# EAGLE schematic AMR3350 (EAGLE 9.4.1)
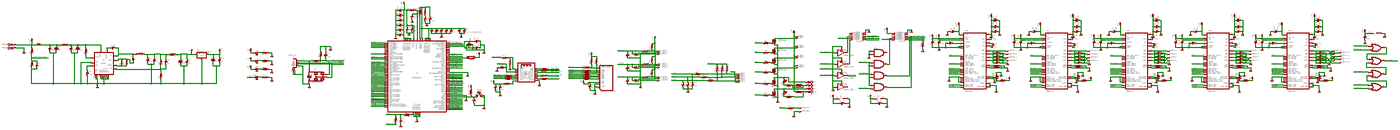
[diagram p0: schematic, sheet 1, overview]
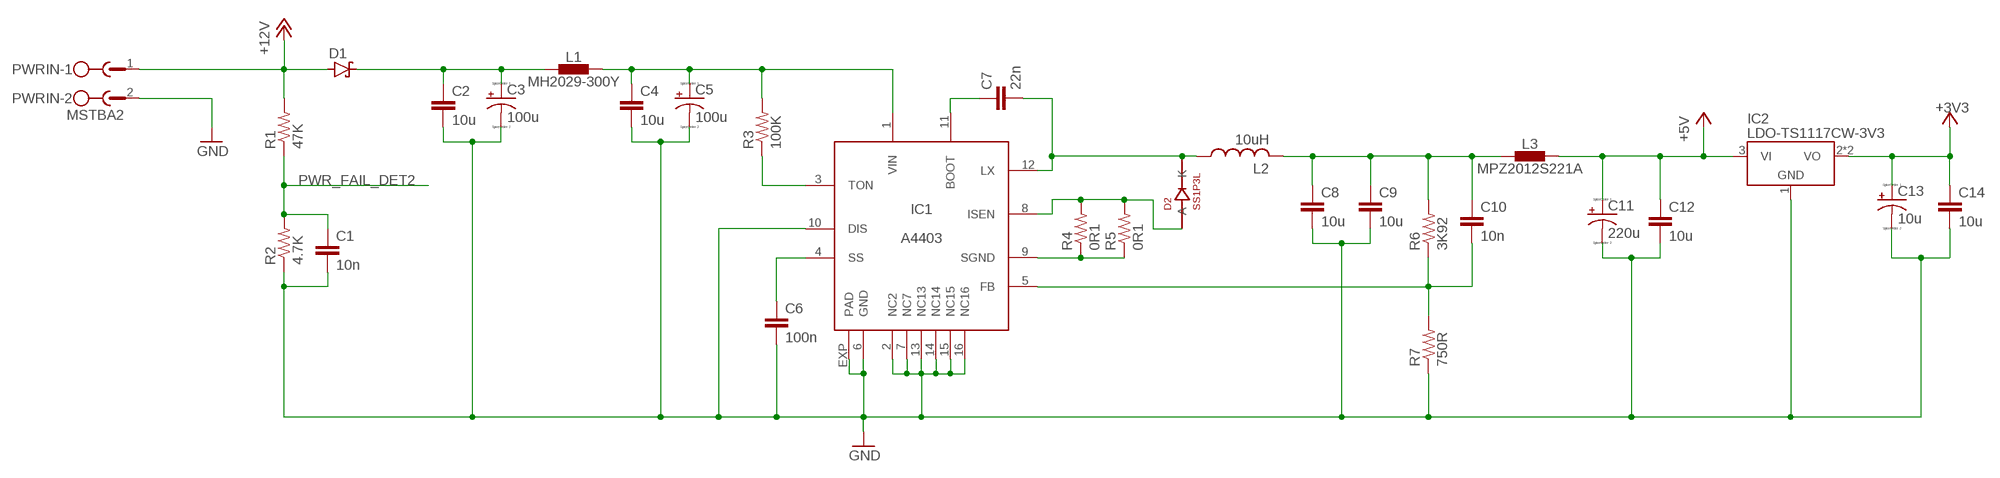
[diagram p1: schematic, sheet 1, part 1 of 6]
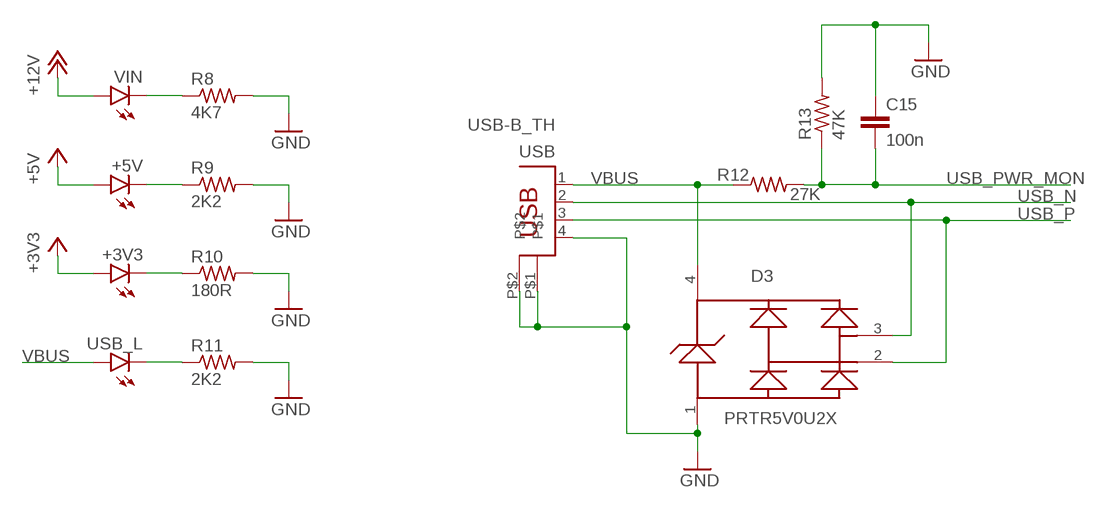
[diagram p2: schematic, sheet 1, part 2 of 6]
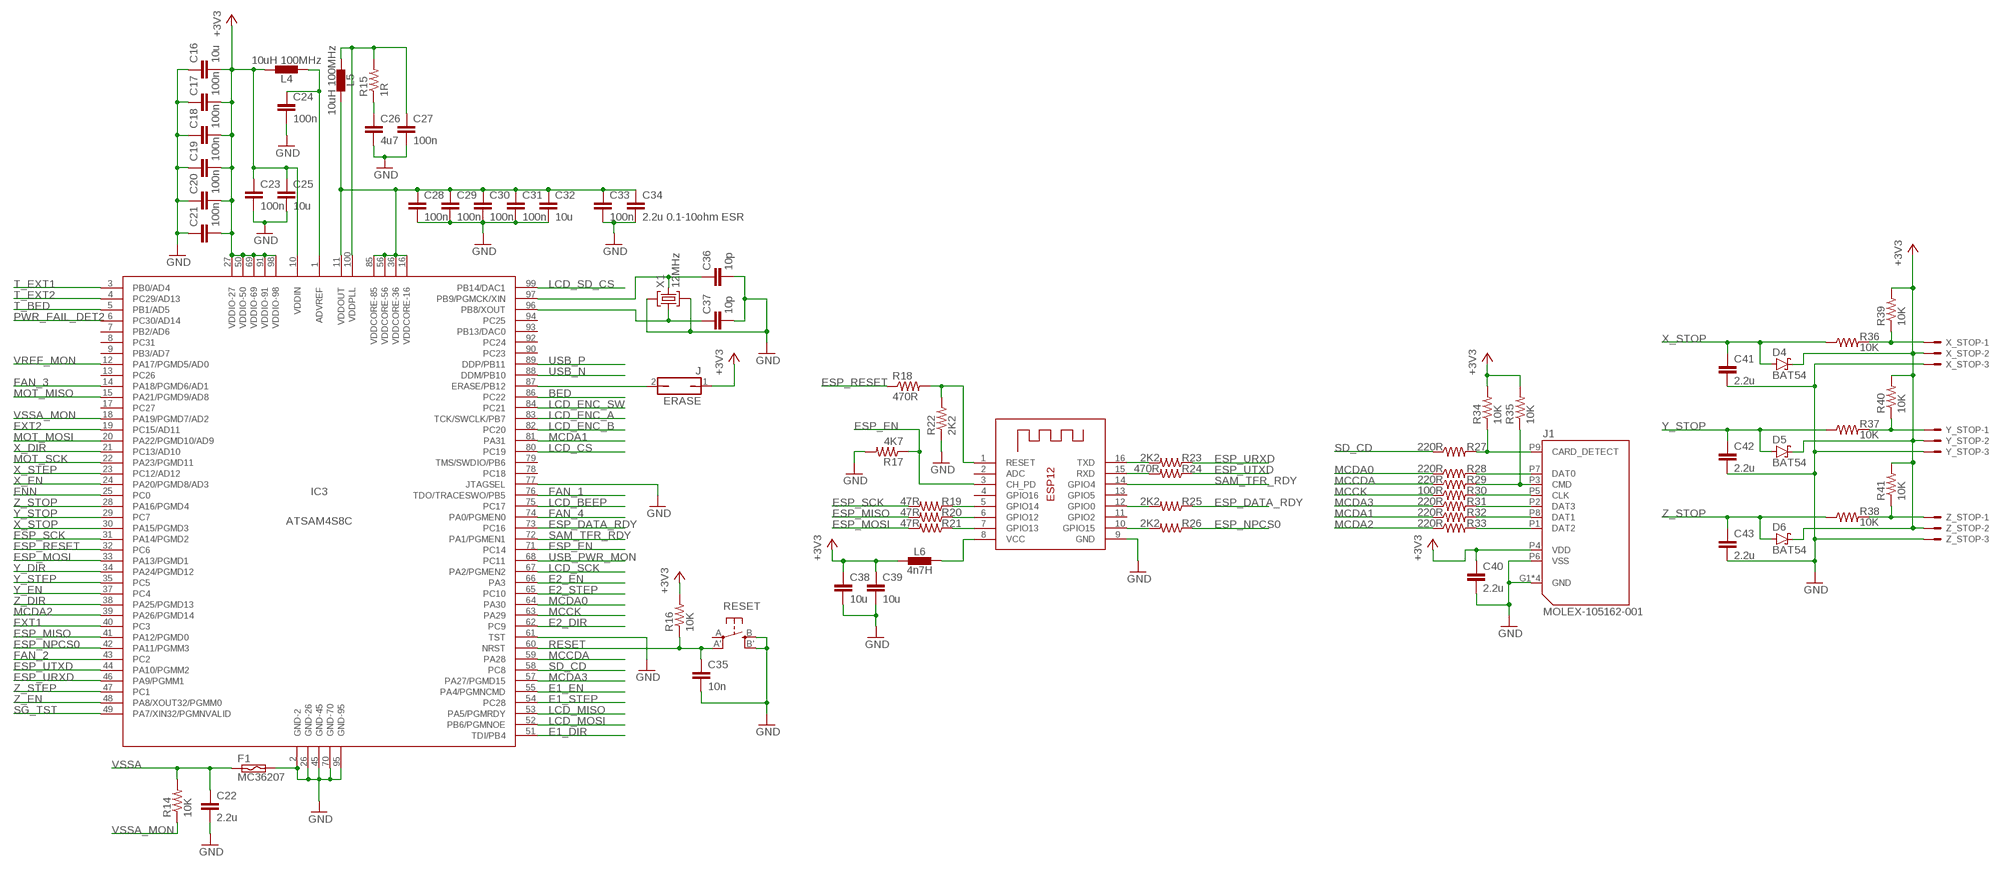
[diagram p3: schematic, sheet 1, part 3 of 6]
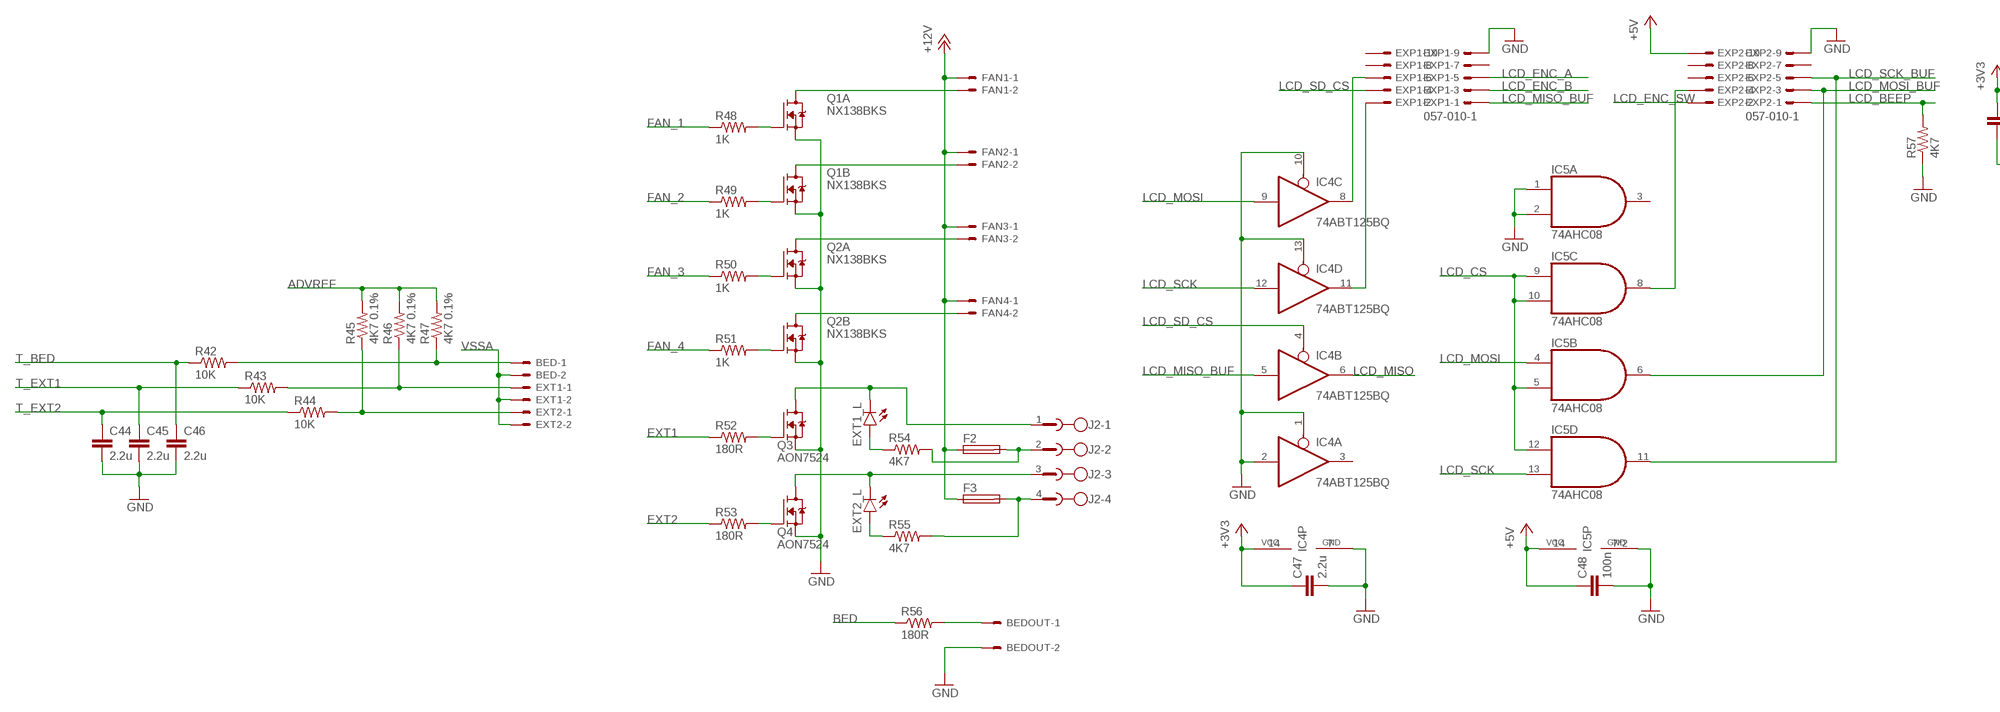
[diagram p4: schematic, sheet 1, part 4 of 6]
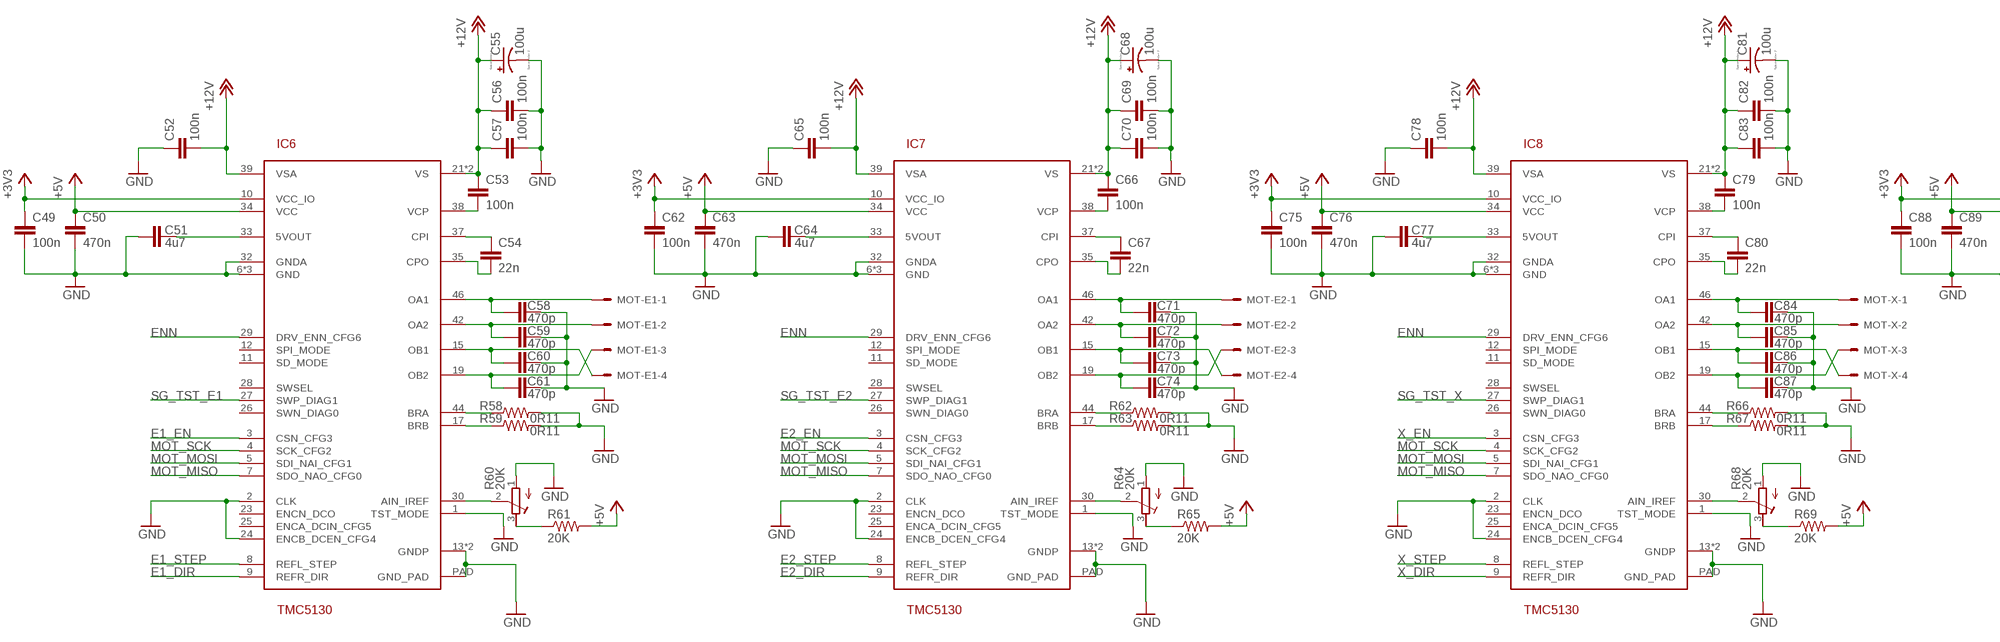
[diagram p5: schematic, sheet 1, part 5 of 6]
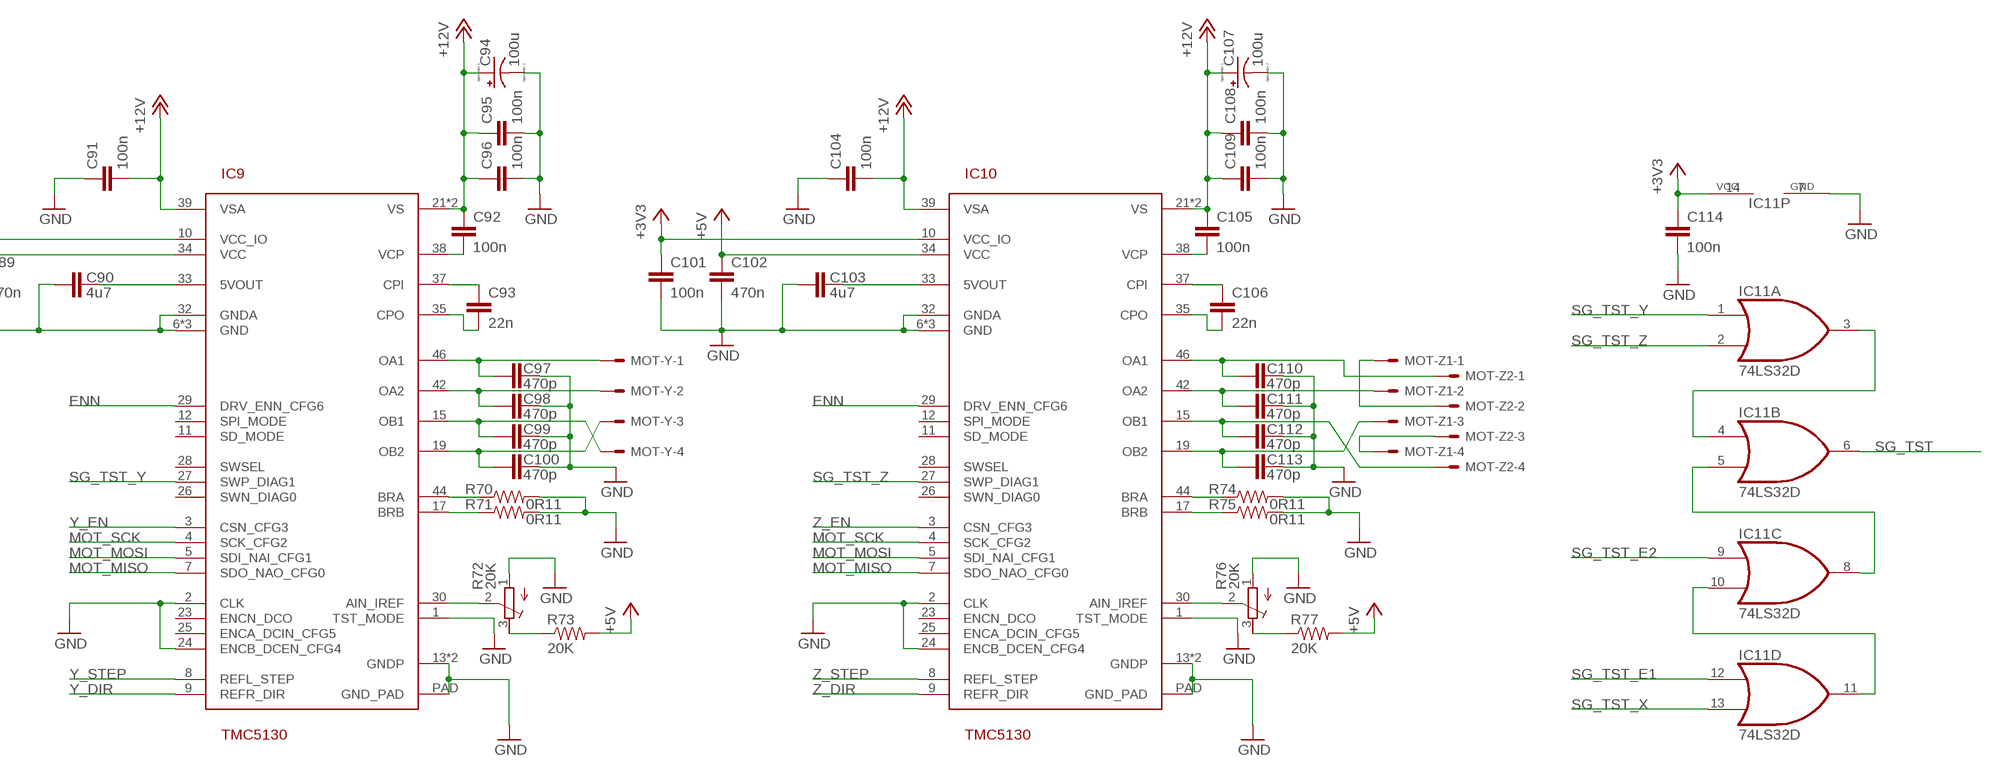
[diagram p6: schematic, sheet 1, part 6 of 6]

## Parts
+3V3  LEDCHIPLED_0805  [CHIPLED_0805]
+5V  LEDCHIPLED_0805  [CHIPLED_0805]
BED  KK-254-2  [MOLEX-KK-254-2]
BEDOUT  KK-254-2  [MOLEX-KK-254-2]
C1  10n  C-EUC0603  [C0603]
C2  10u  C-EUC0603  [C0603]
C3  100u  CPOL-USD  [PANASONIC_D]
C4  10u  C-EUC0603  [C0603]
C5  100u  CPOL-USD  [PANASONIC_D]
C6  100n  C-EUC0603  [C0603]
C7  22n  C-EUC0603  [C0603]
C8  10u  C-EUC0603  [C0603]
C9  10u  C-EUC0603  [C0603]
C10  10n  C-EUC0603  [C0603]
C11  220u  CPOL-USD  [PANASONIC_D]
C12  10u  C-EUC0603  [C0603]
C13  10u  CPOL-USD  [PANASONIC_D]
C14  10u  C-EUC0603  [C0603]
C15  100n  C-EUC0603  [C0603]
C16  10u  C-EUC0805  [C0805]
C17  100n  C-EUC0603  [C0603]
C18  100n  C-EUC0603  [C0603]
C19  100n  C-EUC0603  [C0603]
C20  100n  C-EUC0603  [C0603]
C21  100n  C-EUC0603  [C0603]
C22  2.2u  C-EUC0603  [C0603]
C23  100n  C-EUC0603  [C0603]
C24  100n  C-EUC0603  [C0603]
C25  10u  C-EUC0603  [C0603]
C26  4u7  C-EUC0603  [C0603]
C27  100n  C-EUC0603  [C0603]
C28  100n  C-EUC0603  [C0603]
C29  100n  C-EUC0603  [C0603]
C30  100n  C-EUC0603  [C0603]
C31  100n  C-EUC0603  [C0603]
C32  10u  C-EUC0805  [C0805]
C33  100n  C-EUC0603  [C0603]
C34  2.2u 0.1-10ohm ESR  C-EUC0603  [C0603]
C35  10n  C-EUC0603  [C0603]
C36  10p  C-EUC0603  [C0603]
C37  10p  C-EUC0603  [C0603]
C38  10u  C-EUC0603  [C0603]
C39  10u  C-EUC0603  [C0603]
C40  2.2u  C-EUC0603  [C0603]
C41  2.2u  C-EUC0603  [C0603]
C42  2.2u  C-EUC0603  [C0603]
C43  2.2u  C-EUC0603  [C0603]
C44  2.2u  C-EUC0603  [C0603]
C45  2.2u  C-EUC0603  [C0603]
C46  2.2u  C-EUC0603  [C0603]
C47  2.2u  C-EUC0603  [C0603]
C48  100n  C-EUC0603  [C0603]
C49  100n  C-EUC0603  [C0603]
C50  470n  C-EUC0603  [C0603]
C51  4u7  C-EUC0603  [C0603]
C52  100n  C-EUC0603  [C0603]
C53  100n  C-EUC0603  [C0603]
C54  22n  C-EUC0603  [C0603]
C55  100u  CPOL-USD  [PANASONIC_D]
C56  100n  C-EUC0603  [C0603]
C57  100n  C-EUC0603  [C0603]
C58  470p  C-EUC0402  [C0402]
C59  470p  C-EUC0402  [C0402]
C60  470p  C-EUC0402  [C0402]
C61  470p  C-EUC0402  [C0402]
C62  100n  C-EUC0603  [C0603]
C63  470n  C-EUC0603  [C0603]
C64  4u7  C-EUC0603  [C0603]
C65  100n  C-EUC0603  [C0603]
C66  100n  C-EUC0603  [C0603]
C67  22n  C-EUC0603  [C0603]
C68  100u  CPOL-USD  [PANASONIC_D]
C69  100n  C-EUC0603  [C0603]
C70  100n  C-EUC0603  [C0603]
C71  470p  C-EUC0402  [C0402]
C72  470p  C-EUC0402  [C0402]
C73  470p  C-EUC0402  [C0402]
C74  470p  C-EUC0402  [C0402]
C75  100n  C-EUC0603  [C0603]
C76  470n  C-EUC0603  [C0603]
C77  4u7  C-EUC0603  [C0603]
C78  100n  C-EUC0603  [C0603]
C79  100n  C-EUC0603  [C0603]
C80  22n  C-EUC0603  [C0603]
C81  100u  CPOL-USD  [PANASONIC_D]
C82  100n  C-EUC0603  [C0603]
C83  100n  C-EUC0603  [C0603]
C84  470p  C-EUC0402  [C0402]
C85  470p  C-EUC0402  [C0402]
C86  470p  C-EUC0402  [C0402]
C87  470p  C-EUC0402  [C0402]
C88  100n  C-EUC0603  [C0603]
C89  470n  C-EUC0603  [C0603]
C90  4u7  C-EUC0603  [C0603]
C91  100n  C-EUC0603  [C0603]
C92  100n  C-EUC0603  [C0603]
C93  22n  C-EUC0603  [C0603]
C94  100u  CPOL-USD  [PANASONIC_D]
C95  100n  C-EUC0603  [C0603]
C96  100n  C-EUC0603  [C0603]
C97  470p  C-EUC0402  [C0402]
C98  470p  C-EUC0402  [C0402]
C99  470p  C-EUC0402  [C0402]
C100  470p  C-EUC0402  [C0402]
C101  100n  C-EUC0603  [C0603]
C102  470n  C-EUC0603  [C0603]
C103  4u7  C-EUC0603  [C0603]
C104  100n  C-EUC0603  [C0603]
C105  100n  C-EUC0603  [C0603]
C106  22n  C-EUC0603  [C0603]
C107  100u  CPOL-USD  [PANASONIC_D]
C108  100n  C-EUC0603  [C0603]
C109  100n  C-EUC0603  [C0603]
C110  470p  C-EUC0402  [C0402]
C111  470p  C-EUC0402  [C0402]
C112  470p  C-EUC0402  [C0402]
C113  470p  C-EUC0402  [C0402]
C114  100n  C-EUC0603  [C0603]
D1  SCHOTTKY-DIODESMD  [SMB]
D2  SS1P3L  0025_SS1P3L-M3/84A  [DO220AAL]
D3  PRTR5V0U2XB  [SOT143B]
D4  BAT54  [SOT23]
D5  BAT54  [SOT23]
D6  BAT54  [SOT23]
ERASE  J  [1X02]
ESP8266  ESP-12  [ESP-12]
EXP1  057-010-1  [057-010-1]
EXP2  057-010-1  [057-010-1]
EXT1  KK-254-2  [MOLEX-KK-254-2]
EXT1_L  LEDCHIPLED_0805  [CHIPLED_0805]
EXT2  KK-254-2  [MOLEX-KK-254-2]
EXT2_L  LEDCHIPLED_0805  [CHIPLED_0805]
F1  MC36207  [MC36207]
F2  19560  [19560]
F3  19560  [19560]
FAN1  KK-254-2  [MOLEX-KK-254-2]
FAN2  KK-254-2  [MOLEX-KK-254-2]
FAN3  KK-254-2  [MOLEX-KK-254-2]
FAN4  KK-254-2  [MOLEX-KK-254-2]
IC1  A4403  [QFN16-4X4]
IC2  LDO-TS1117CW-3V3  [SOT223]
IC3  ATSAM4S8C  [LQFP100]
IC4  74ABT125BQ  [DHVQFN14]
IC5  74AHC08  [DHVQFN14]
IC6  TMC5130  [QFP50P900X900X113-49N_NOFID]
IC7  TMC5130  [QFP50P900X900X113-49N_NOFID]
IC8  TMC5130  [QFP50P900X900X113-49N_NOFID]
IC9  TMC5130  [QFP50P900X900X113-49N_NOFID]
IC10  TMC5130  [QFP50P900X900X113-49N_NOFID]
IC11  74LS32D  [SO14]
J1  MOLEX-105162-001  [MOLEX-105162]
J2  MSTBV4  [MSTBV4]
L1  MH2029-300Y  INDUCTOR-0805  [C0805]
L2  10uH  L-USSRR0604  [SRR0604]
L3  MPZ2012S221A  INDUCTOR-0805  [C0805]
L4  10uH 100MHz  INDUCTOR-0603  [C0603]
L5  10uH 100MHz  INDUCTOR-0603  [C0603]
L6  4n7H  INDUCTOR-0603  [C0603]
MOT-E1  KK-254-4  [MOLEX-KK-254-4]
MOT-E2  KK-254-4  [MOLEX-KK-254-4]
MOT-X  KK-254-4  [MOLEX-KK-254-4]
MOT-Y  KK-254-4  [MOLEX-KK-254-4]
MOT-Z1  KK-254-4  [MOLEX-KK-254-4]
MOT-Z2  KK-254-4  [MOLEX-KK-254-4]
PWRIN  MSTBA2  [MSTBA2]
Q1  NX138BKS  [SOT363_PHILIPS]
Q2  NX138BKS  [SOT363_PHILIPS]
Q3  AON7524  [3X3DFN-EP]
Q4  AON7524  [3X3DFN-EP]
R1  47K  R-US_R0603  [R0603]
R2  4.7K  R-US_R0603  [R0603]
R3  100K  R-US_R0603  [R0603]
R4  0R1  R-US_R0603  [R0603]
R5  0R1  R-US_R0603  [R0603]
R6  3K92  R-US_R0603  [R0603]
R7  750R  R-US_R0603  [R0603]
R8  4K7  R-US_R0603  [R0603]
R9  2K2  R-US_R0603  [R0603]
R10  180R  R-US_R0603  [R0603]
R11  2K2  R-US_R0603  [R0603]
R12  27K  R-US_R0603  [R0603]
R13  47K  R-US_R0603  [R0603]
R14  10K  R-US_R0603  [R0603]
R15  1R  R-US_R0603  [R0603]
R16  10K  R-US_R0603  [R0603]
R17  4K7  R-US_R0603  [R0603]
R18  470R  R-US_R0603  [R0603]
R19  47R  R-US_R0603  [R0603]
R20  47R  R-US_R0603  [R0603]
R21  47R  R-US_R0603  [R0603]
R22  2K2  R-US_R0603  [R0603]
R23  2K2  R-US_R0603  [R0603]
R24  470R  R-US_R0603  [R0603]
R25  2K2  R-US_R0603  [R0603]
R26  2K2  R-US_R0603  [R0603]
R27  220R  R-US_R0603  [R0603]
R28  220R  R-US_R0603  [R0603]
R29  220R  R-US_R0603  [R0603]
R30  100R  R-US_R0603  [R0603]
R31  220R  R-US_R0603  [R0603]
R32  220R  R-US_R0603  [R0603]
R33  220R  R-US_R0603  [R0603]
R34  10K  R-US_R0603  [R0603]
R35  10K  R-US_R0603  [R0603]
R36  10K  R-US_R0603  [R0603]
R37  10K  R-US_R0603  [R0603]
R38  10K  R-US_R0603  [R0603]
R39  10K  R-US_R0603  [R0603]
R40  10K  R-US_R0603  [R0603]
R41  10K  R-US_R0603  [R0603]
R42  10K  R-US_R0603  [R0603]
R43  10K  R-US_R0603  [R0603]
R44  10K  R-US_R0603  [R0603]
R45  4K7 0.1%  R-US_R0603  [R0603]
R46  4K7 0.1%  R-US_R0603  [R0603]
R47  4K7 0.1%  R-US_R0603  [R0603]
R48  1K  R-US_R0603  [R0603]
R49  1K  R-US_R0603  [R0603]
R50  1K  R-US_R0603  [R0603]
R51  1K  R-US_R0603  [R0603]
R52  180R  R-US_R0603  [R0603]
R53  180R  R-US_R0603  [R0603]
R54  4K7  R-US_R0603  [R0603]
R55  4K7  R-US_R0603  [R0603]
R56  180R  R-US_R0603  [R0603]
R57  4K7  R-US_R0603  [R0603]
R58  0R11  R-US_R1206  [R1206]
R59  0R11  R-US_R1206  [R1206]
R60  20K  R-TRIMM3103  [RTRIM3103]
R61  20K  R-US_R0603  [R0603]
R62  0R11  R-US_R1206  [R1206]
R63  0R11  R-US_R1206  [R1206]
R64  20K  R-TRIMM3103  [RTRIM3103]
R65  20K  R-US_R0603  [R0603]
R66  0R11  R-US_R1206  [R1206]
R67  0R11  R-US_R1206  [R1206]
R68  20K  R-TRIMM3103  [RTRIM3103]
R69  20K  R-US_R0603  [R0603]
R70  0R11  R-US_R1206  [R1206]
R71  0R11  R-US_R1206  [R1206]
R72  20K  R-TRIMM3103  [RTRIM3103]
R73  20K  R-US_R0603  [R0603]
R74  0R11  R-US_R1206  [R1206]
R75  0R11  R-US_R1206  [R1206]
R76  20K  R-TRIMM3103  [RTRIM3103]
R77  20K  R-US_R0603  [R0603]
RESET  EVQQ2  [EVQQ2]
USB  USB-B_TH  PN61729  [PN61729]
USB_L  LEDCHIPLED_0805  [CHIPLED_0805]
VIN  LEDCHIPLED_0805  [CHIPLED_0805]
X1  12MHz  CRYSTAL-4PIN  [5.0X3.2_KX-9A]
X_STOP  KK-254-3  [MOLEX-KK-254-3]
Y_STOP  KK-254-3  [MOLEX-KK-254-3]
Z_STOP  KK-254-3  [MOLEX-KK-254-3]

## Nets
3V3_LED: +3V3.C R10.1
5V_E1: C51.1 IC6.33(5VOUT)
5V_E2: C64.1 IC7.33(5VOUT)
5V_LED: +5V.C R9.1
5V_X: C77.1 IC8.33(5VOUT)
5V_Y: C90.1 IC9.33(5VOUT)
5V_Z: C103.1 IC10.33(5VOUT)
12V_LED: R8.1 VIN.C
+3V3: +3V3.A C13.+ C14.1 C16.2 C17.2 C18.2 C19.2 C20.2 C21.2 C23.1 C25.1 C38.1 C39.1 C40.1 C47.1 C49.1 C62.1 C75.1 C88.1 C101.1 C114.1 D4.3(C) D5.3(C) D6.3(C) ERASE.1 IC2.2(VO) IC2.4(VO) IC3.10(VDDIN) IC3.27(VDDIO-27) IC3.50(VDDIO-50) IC3.69(VDDIO-69) IC3.91(VDDIO-91) IC3.98(VDDIO-98) IC4.14(P:VCC) IC6.10(VCC_IO) IC7.10(VCC_IO) IC8.10(VCC_IO) IC9.10(VCC_IO) IC10.10(VCC_IO) IC11.14(P:VCC) J1.P4(VDD) L4.2 L6.1 R16.2 R34.2 R35.2 R39.2 R40.2 R41.2 X_STOP.2 Y_STOP.2 Z_STOP.2
+5V: +5V.A C11.+ C12.1 C48.1 C50.1 C63.1 C76.1 C89.1 C102.1 EXP2.10 IC2.3(VI) IC5.14(P:VCC) IC6.34(VCC) IC7.34(VCC) IC8.34(VCC) IC9.34(VCC) IC10.34(VCC) L3.2 R61.2 R65.2 R69.2 R73.2 R77.2
+12V: C52.2 C53.1 C55.+ C56.1 C57.1 C65.2 C66.1 C68.+ C69.1 C70.1 C78.2 C79.1 C81.+ C82.1 C83.1 C91.2 C92.1 C94.+ C95.1 C96.1 C104.2 C105.1 C107.+ C108.1 C109.1 D1.A F2.1 F3.1 FAN1.1 FAN2.1 FAN3.1 FAN4.1 IC6.21(VS) IC6.39(VSA) IC6.40(VS) IC7.21(VS) IC7.39(VSA) IC7.40(VS) IC8.21(VS) IC8.39(VSA) IC8.40(VS) IC9.21(VS) IC9.39(VSA) IC9.40(VS) IC10.21(VS) IC10.39(VSA) IC10.40(VS) PWRIN.1 R1.2 VIN.A
A1_E1: C58.1 IC6.46(OA1) MOT-E1.1
A1_E2: C71.1 IC7.46(OA1) MOT-E2.1
A1_X: C84.1 IC8.46(OA1) MOT-X.1
A1_Y: C97.1 IC9.46(OA1) MOT-Y.1
A1_Z: C110.1 IC10.46(OA1) MOT-Z2.1
A2_E1: C59.1 IC6.42(OA2) MOT-E1.2
A2_E2: C72.1 IC7.42(OA2) MOT-E2.2
A2_X: C85.1 IC8.42(OA2) MOT-X.2
A2_Y: C98.1 IC9.42(OA2) MOT-Y.2
A2_Z: C111.1 IC10.42(OA2) MOT-Z1.2
A_Z: MOT-Z1.1 MOT-Z2.2
ADVREF: C24.1 IC3.1(ADVREF) L4.1 R45.2 R46.2 R47.2
B1_E1: C60.1 IC6.15(OB1) MOT-E1.4
B1_E2: C73.1 IC7.15(OB1) MOT-E2.4
B1_X: C86.1 IC8.15(OB1) MOT-X.4
B1_Y: C99.1 IC9.15(OB1) MOT-Y.4
B1_Z: C112.1 IC10.15(OB1) MOT-Z2.4
B2_E1: C61.1 IC6.19(OB2) MOT-E1.3
B2_E2: C74.1 IC7.19(OB2) MOT-E2.3
B2_X: C87.1 IC8.19(OB2) MOT-X.3
B2_Y: C100.1 IC9.19(OB2) MOT-Y.3
B2_Z: C113.1 IC10.19(OB2) MOT-Z1.3
B_Z: MOT-Z1.4 MOT-Z2.3
BED: IC3.86(PC22) R56.1
BED_L: EXT2_L.A R55.1
BED_OUT: BEDOUT.1 R56.2
BOOT: C7.1 IC1.11(BOOT)
BRA_E1: IC6.44(BRA) R58.1
BRA_E2: IC7.44(BRA) R62.1
BRA_X: IC8.44(BRA) R66.1
BRA_Y: IC9.44(BRA) R70.1
BRA_Z: IC10.44(BRA) R74.1
BRB_E1: IC6.17(BRB) R59.1
BRB_E2: IC7.17(BRB) R63.1
BRB_X: IC8.17(BRB) R67.1
BRB_Y: IC9.17(BRB) R71.1
BRB_Z: IC10.17(BRB) R75.1
CLK: J1.P5(CLK) R30.2
CMD: J1.P3(CMD) R29.2 R35.1
CPI_E1: C54.1 IC6.37(CPI)
CPI_E2: C67.1 IC7.37(CPI)
CPI_X: C80.1 IC8.37(CPI)
CPI_Y: C93.1 IC9.37(CPI)
CPI_Z: C106.1 IC10.37(CPI)
CPO_E1: C54.2 IC6.35(CPO)
CPO_E2: C67.2 IC7.35(CPO)
CPO_X: C80.2 IC8.35(CPO)
CPO_Y: C93.2 IC9.35(CPO)
CPO_Z: C106.2 IC10.35(CPO)
DAT0: J1.P7(DAT0) R28.2
DAT1: J1.P8(DAT1) R32.2
DAT2: J1.P1(DAT2) R33.2
DAT3: J1.P2(DAT3) R31.2
DET: J1.P9(CARD_DETECT) R27.2 R34.1
E1_DIR: IC3.51(TDI/PB4) IC6.9(REFR_DIR)
E1_EN: IC3.55(PA4/PGMNCMD) IC6.3(CSN_CFG3)
E1_FUSED: F2.2 J2.2 R54.2
E1_STEP: IC3.54(PC28) IC6.8(REFL_STEP)
E2_DIR: IC3.62(PC9) IC7.9(REFR_DIR)
E2_EN: IC3.66(PA3) IC7.3(CSN_CFG3)
E2_FUSED: F3.2 J2.4 R55.2
E2_STEP: IC3.65(PC10) IC7.8(REFL_STEP)
EDR_CONN: ESP8266.12(GPIO0) R25.2
ENN: IC3.25(PC0) IC6.29(DRV_ENN_CFG6) IC7.29(DRV_ENN_CFG6) IC8.29(DRV_ENN_CFG6) IC9.29(DRV_ENN_CFG6) IC10.29(DRV_ENN_CFG6)
ERASE: ERASE.2 IC3.87(ERASE/PB12)
ESP_CS: ESP8266.10(GPIO15) R26.2
ESP_DATA_RDY: IC3.73(PC16) R25.1
ESP_EN: ESP8266.3(CH_PD) IC3.71(PC14) R17.1
ESP_MISO: IC3.41(PA12/PGMD0) R20.2
ESP_MOSI: IC3.33(PA13/PGMD1) R21.2
ESP_NPCS0: IC3.42(PA11/PGMM3) R26.1
ESP_RESET: IC3.32(PC6) R18.1
ESP_RST: ESP8266.1(RESET) R18.2 R22.2
ESP_RXD: ESP8266.16(TXD) R23.2
ESP_SCK: IC3.31(PA14/PGMD2) R19.2
ESP_TXD: ESP8266.15(RXD) R24.2
ESP_URXD: IC3.46(PA9/PGMM1) R23.1
ESP_UTXD: IC3.44(PA10/PGMM2) R24.1
ESP_VIN: ESP8266.8(VCC) L6.2
EXT1: IC3.40(PC3) R52.1
EXT1_D: EXT1_L.C J2.1 Q3.5(D) Q3.6(D) Q3.7(D) Q3.8(D) Q3.E1(D) Q3.E2(D) Q3.PAD(D)
EXT1_G: Q3.4(G) R52.2
EXT2: IC3.19(PC15/AD11) R53.1
EXT2_D: EXT2_L.C J2.3 Q4.5(D) Q4.6(D) Q4.7(D) Q4.8(D) Q4.E1(D) Q4.E2(D) Q4.PAD(D)
EXT2_G: Q4.4(G) R53.2
EXT_L: EXT1_L.A R54.1
FAN1_D: FAN1.2 Q1.6(A:D)
FAN1_G: Q1.2(A:G) R48.2
FAN2_D: FAN2.2 Q1.3(B:D)
FAN2_G: Q1.5(B:G) R49.2
FAN3_D: FAN3.2 Q2.6(A:D)
FAN3_G: Q2.2(A:G) R50.2
FAN4_D: FAN4.2 Q2.3(B:D)
FAN4_G: Q2.5(B:G) R51.2
FAN_1: IC3.76(TDO/TRACESWO/PB5) R48.1
FAN_2: IC3.43(PC2) R49.1
FAN_3: IC3.14(PA18/PGMD6/AD1) R50.1
FAN_4: IC3.74(PA0/PGMEN0) R51.1
FB: C10.2 IC1.5(FB) R6.1 R7.2
GND: BEDOUT.2 C1.2 C2.2 C3.- C4.2 C5.- C6.2 C8.2 C9.2 C11.- C12.2 C13.- C14.2 C15.1 C16.1 C17.1 C18.1 C19.1 C20.1 C21.1 C22.2 C23.2 C24.2 C25.2 C26.2 C27.2 C28.2 C29.2 C30.2 C31.2 C32.2 C33.2 C34.2 C35.2 C36.2 C37.2 C38.2 C39.2 C40.2 C41.2 C42.2 C43.2 C44.2 C45.2 C46.2 C47.2 C48.2 C49.2 C50.2 C51.2 C52.1 C55.- C56.2 C57.2 C58.2 C59.2 C60.2 C61.2 C62.2 C63.2 C64.2 C65.1 C68.- C69.2 C70.2 C71.2 C72.2 C73.2 C74.2 C75.2 C76.2 C77.2 C78.1 C81.- C82.2 C83.2 C84.2 C85.2 C86.2 C87.2 C88.2 C89.2 C90.2 C91.1 C94.- C95.2 C96.2 C97.2 C98.2 C99.2 C100.2 C101.2 C102.2 C103.2 C104.1 C107.- C108.2 C109.2 C110.2 C111.2 C112.2 C113.2 C114.2 D3.1 ESP8266.9(GND) EXP1.9 EXP2.9 F1.2 IC1.2(NC2) IC1.6(GND) IC1.7(NC7) IC1.10(DIS) IC1.13(NC13) IC1.14(NC14) IC1.15(NC15) IC1.16(NC16) IC1.EXP(PAD) IC2.1(GND) IC3.2(GND-2) IC3.26(GND-26) IC3.45(GND-45) IC3.61(TST) IC3.70(GND-70) IC3.77(JTAGSEL) IC3.95(GND-95) IC4.1(A:OE) IC4.2(A:I) IC4.7(P:GND) IC4.10(C:OE) IC4.13(D:OE) IC5.1(A:I0) IC5.2(A:I1) IC5.7(P:GND) IC5.EXP(P:GND) IC6.1(TST_MODE) IC6.2(CLK) IC6.6(GND) IC6.13(GNDP) IC6.24(ENCB_DCEN_CFG4) IC6.31(GND) IC6.32(GNDA) IC6.36(GND) IC6.48(GNDP) IC6.PAD(GND_PAD) IC7.1(TST_MODE) IC7.2(CLK) IC7.6(GND) IC7.13(GNDP) IC7.24(ENCB_DCEN_CFG4) IC7.31(GND) IC7.32(GNDA) IC7.36(GND) IC7.48(GNDP) IC7.PAD(GND_PAD) IC8.1(TST_MODE) IC8.2(CLK) IC8.6(GND) IC8.13(GNDP) IC8.24(ENCB_DCEN_CFG4) IC8.31(GND) IC8.32(GNDA) IC8.36(GND) IC8.48(GNDP) IC8.PAD(GND_PAD) IC9.1(TST_MODE) IC9.2(CLK) IC9.6(GND) IC9.13(GNDP) IC9.24(ENCB_DCEN_CFG4) IC9.31(GND) IC9.32(GNDA) IC9.36(GND) IC9.48(GNDP) IC9.PAD(GND_PAD) IC10.1(TST_MODE) IC10.2(CLK) IC10.6(GND) IC10.13(GNDP) IC10.24(ENCB_DCEN_CFG4) IC10.31(GND) IC10.32(GNDA) IC10.36(GND) IC10.48(GNDP) IC10.PAD(GND_PAD) IC11.7(P:GND) J1.G1(GND) J1.G2(GND) J1.G3(GND) J1.G4(GND) J1.P6(VSS) PWRIN.2 Q1.1(A:S) Q1.4(B:S) Q2.1(A:S) Q2.4(B:S) Q3.1(S) Q3.2(S) Q3.3(S) Q4.1(S) Q4.2(S) Q4.3(S) R2.1 R7.1 R8.2 R9.2 R10.2 R11.2 R13.2 R17.2 R22.1 R57.1 R58.2 R59.2 R60.1(A) R62.2 R63.2 R64.1(A) R66.2 R67.2 R68.1(A) R70.2 R71.2 R72.1(A) R74.2 R75.2 R76.1(A) RESET.B'(S1) RESET.B(S) USB.4 USB.P$1 USB.P$2 X1.2 X1.4 X_STOP.3 Y_STOP.3 Z_STOP.3
IDEK: C26.1 R15.1
IREF_E1: IC6.30(AIN_IREF) R60.2(S)
IREF_E2: IC7.30(AIN_IREF) R64.2(S)
IREF_X: IC8.30(AIN_IREF) R68.2(S)
IREF_Y: IC9.30(AIN_IREF) R72.2(S)
IREF_Z: IC10.30(AIN_IREF) R76.2(S)
ISEN: D2.P$2(A) IC1.8(ISEN) R4.2 R5.2
LCD_BEEP: EXP2.1 IC3.75(PC17) R57.2
LCD_CS: IC3.80(PC19) IC5.5(B:I1) IC5.9(C:I0) IC5.10(C:I1) IC5.12(D:I0)
LCD_CS_BUF: EXP2.4 IC5.8(C:O)
LCD_ENC_A: EXP1.5 IC3.83(TCK/SWCLK/PB7)
LCD_ENC_B: EXP1.3 IC3.82(PC20)
LCD_ENC_SW: EXP2.2 IC3.84(PC21)
LCD_MISO: IC3.53(PA5/PGMRDY) IC4.6(B:O)
LCD_MISO_BUF: EXP1.1 IC4.5(B:I)
LCD_MOSI: IC3.52(PB6/PGMNOE) IC4.9(C:I) IC5.4(B:I0)
LCD_MOSI_BUF: EXP2.3 IC5.6(B:O)
LCD_SCK: IC3.67(PA2/PGMEN2) IC4.12(D:I) IC5.13(D:I1)
LCD_SCK_BUF: EXP2.5 IC5.11(D:O)
LCD_SD_CS: EXP1.4 IC3.99(PB14/DAC1) IC4.4(B:OE)
LX: C7.2 D2.P$1(K) IC1.12(LX) L2.P$1
MCCDA: IC3.59(PA28) R29.1
MCCK: IC3.63(PA29) R30.1
MCDA0: IC3.64(PA30) R28.1
MCDA1: IC3.81(PA31) R32.1
MCDA2: IC3.39(PA26/PGMD14) R33.1
MCDA3: IC3.57(PA27/PGMD15) R31.1
MISO: ESP8266.6(GPIO12) R20.1
MOSI: ESP8266.7(GPIO13) R21.1
MOT_MISO: IC3.15(PA21/PGMD9/AD8) IC6.7(SDO_NAO_CFG0) IC7.7(SDO_NAO_CFG0) IC8.7(SDO_NAO_CFG0) IC9.7(SDO_NAO_CFG0) IC10.7(SDO_NAO_CFG0)
MOT_MOSI: IC3.20(PA22/PGMD10/AD9) IC6.5(SDI_NAI_CFG1) IC7.5(SDI_NAI_CFG1) IC8.5(SDI_NAI_CFG1) IC9.5(SDI_NAI_CFG1) IC10.5(SDI_NAI_CFG1)
MOT_SCK: IC3.22(PA23/PGMD11) IC6.4(SCK_CFG2) IC7.4(SCK_CFG2) IC8.4(SCK_CFG2) IC9.4(SCK_CFG2) IC10.4(SCK_CFG2)
PWR_FAIL_DET2: C1.1 IC3.6(PC30/AD14) R1.1 R2.2
REFIN_E1: R60.3(E) R61.1
REFIN_E2: R64.3(E) R65.1
REFIN_X: R68.3(E) R69.1
REFIN_Y: R72.3(E) R73.1
REFIN_Z: R76.3(E) R77.1
RESET: C35.1 IC3.60(NRST) R16.1 RESET.A'(P1)
SAM_TFR_RDY: ESP8266.14(GPIO4) IC3.72(PA1/PGMEN1)
SD_CD: IC3.58(PC8) R27.1
SD_MOSI_BUF: EXP1.6 IC4.8(C:O)
SD_SCK_BUF: EXP1.2 IC4.11(D:O)
SG_TST: IC3.49(PA7/XIN32/PGMNVALID) IC11.6(B:O)
SG_TST_E1: IC6.27(SWP_DIAG1) IC11.12(D:I0)
SG_TST_E1X: IC11.10(C:I1) IC11.11(D:O)
SG_TST_E2: IC7.27(SWP_DIAG1) IC11.9(C:I0)
SG_TST_EX: IC11.5(B:I1) IC11.8(C:O)
SG_TST_X: IC8.27(SWP_DIAG1) IC11.13(D:I1)
SG_TST_Y: IC9.27(SWP_DIAG1) IC11.1(A:I0)
SG_TST_YZ: IC11.3(A:O) IC11.4(B:I0)
SG_TST_Z: IC10.27(SWP_DIAG1) IC11.2(A:I1)
SGND: IC1.9(SGND) R4.1 R5.1
SPCK: ESP8266.5(GPIO14) R19.1
SS: C6.1 IC1.4(SS)
T_BED: C46.1 IC3.5(PB1/AD5) R42.1
T_BED_IN: BED.1 R42.2 R47.1
T_EXT1: C45.1 IC3.3(PB0/AD4) R43.1
T_EXT2: C44.1 IC3.4(PC29/AD13) R44.1
T_EXT_IN1: EXT1.1 R43.2 R46.1
T_EXT_IN2: EXT2.1 R44.2 R45.1
TON: IC1.3(TON) R3.1
USB_LED: R11.1 USB_L.C
USB_N [diff]: D3.3 IC3.88(DDM/PB10) USB.2
USB_P [diff]: D3.2 IC3.89(DDP/PB11) USB.3
USB_PWR_MON: C15.2 IC3.68(PC11) R12.2 R13.1
VBUS: D3.4 R12.1 USB.1 USB_L.A
VCP_E1: C53.2 IC6.38(VCP)
VCP_E2: C66.2 IC7.38(VCP)
VCP_X: C79.2 IC8.38(VCP)
VCP_Y: C92.2 IC9.38(VCP)
VCP_Z: C105.2 IC10.38(VCP)
VDDOUT: C28.1 C29.1 C30.1 C31.1 C32.1 C33.1 C34.1 IC3.11(VDDOUT) IC3.16(VDDCORE-16) IC3.36(VDDCORE-36) IC3.56(VDDCORE-56) IC3.85(VDDCORE-85) L5.2
VDDPLL: C27.1 IC3.100(VDDPLL) L5.1 R15.2
VIN: C2.1 C3.+ D1.C L1.1
VIN_F: C4.1 C5.+ IC1.1(VIN) L1.2 R3.2
VOUT: C8.1 C9.1 C10.1 L2.P$2 L3.1 R6.2
VREF_MON: IC3.12(PA17/PGMD5/AD0)
VSSA: BED.2 C22.1 EXT1.2 EXT2.2 F1.1 R14.2
VSSA_MON: IC3.18(PA19/PGMD7/AD2) R14.1
X_DIR: IC3.21(PC13/AD10) IC8.9(REFR_DIR)
X_EN: IC3.24(PA20/PGMD8/AD3) IC8.3(CSN_CFG3)
X_STEP: IC3.23(PC12/AD12) IC8.8(REFL_STEP)
X_STOP: C41.1 D4.1(A) IC3.30(PA15/PGMD3) R36.1
X_STOP_IN: R36.2 R39.1 X_STOP.1
XIN: C36.1 IC3.97(PB9/PGMCK/XIN) X1.3
XOUT: C37.1 IC3.96(PB8/XOUT) X1.1
Y_DIR: IC3.34(PA24/PGMD12) IC9.9(REFR_DIR)
Y_EN: IC3.37(PC4) IC9.3(CSN_CFG3)
Y_STEP: IC3.35(PC5) IC9.8(REFL_STEP)
Y_STOP: C42.1 D5.1(A) IC3.29(PC7) R37.1
Y_STOP_IN: R37.2 R40.1 Y_STOP.1
Z_DIR: IC3.38(PA25/PGMD13) IC10.9(REFR_DIR)
Z_EN: IC3.48(PA8/XOUT32/PGMM0) IC10.3(CSN_CFG3)
Z_STEP: IC3.47(PC1) IC10.8(REFL_STEP)
Z_STOP: C43.1 D6.1(A) IC3.28(PA16/PGMD4) R38.1
Z_STOP_IN: R38.2 R41.1 Z_STOP.1
Unconnected: ESP8266.2(ADC) ESP8266.4(GPIO16) ESP8266.11(GPIO2) ESP8266.13(GPIO5) EXP1.7 EXP1.8 EXP1.10 EXP2.6 EXP2.7 EXP2.8 IC3.7(PB2/AD6) IC3.8(PC31) IC3.9(PB3/AD7) IC3.13(PC26) IC3.17(PC27) IC3.78(PC18) IC3.79(TMS/SWDIO/PB6) IC3.90(PC23) IC3.92(PC24) IC3.93(PB13/DAC0) IC3.94(PC25) IC4.3(A:O) IC5.3(A:O) IC6.11(SD_MODE) IC6.12(SPI_MODE) IC6.23(ENCN_DCO) IC6.25(ENCA_DCIN_CFG5) IC6.26(SWN_DIAG0) IC6.28(SWSEL) IC7.11(SD_MODE) IC7.12(SPI_MODE) IC7.23(ENCN_DCO) IC7.25(ENCA_DCIN_CFG5) IC7.26(SWN_DIAG0) IC7.28(SWSEL) IC8.11(SD_MODE) IC8.12(SPI_MODE) IC8.23(ENCN_DCO) IC8.25(ENCA_DCIN_CFG5) IC8.26(SWN_DIAG0) IC8.28(SWSEL) IC9.11(SD_MODE) IC9.12(SPI_MODE) IC9.23(ENCN_DCO) IC9.25(ENCA_DCIN_CFG5) IC9.26(SWN_DIAG0) IC9.28(SWSEL) IC10.11(SD_MODE) IC10.12(SPI_MODE) IC10.23(ENCN_DCO) IC10.25(ENCA_DCIN_CFG5) IC10.26(SWN_DIAG0) IC10.28(SWSEL) RESET.A(P)

## Library data of the parts
+3V3 +5V EXT1_L EXT2_L USB_L VIN = led:LED: LED OSRAM: - CHIPLED LG R971, LG N971, LY N971, LG Q971, LY Q971, LO R971, LY R971 LH N974, LH R974 LS Q976, LO Q976, LY Q976 LO Q996 - Hyper CHIPLED LW Q18S LB Q993, LB Q99A, LB R99A - SideLED LS A670, LO A670, LY A670, LG A670, LP A670 LB A673, LV A673, LT A673, LW A673 LH A674 LY A675 LS A676, LA A676, LO A676, LY A676, LW A676 LS A679, LY A679, LG A679 - Hyper Micro SIDELED® LS Y876, LA Y876, LO Y876, LY Y876 LT Y87S - SmartLED LW L88C, LW L88S LB L89C, LB L89S, LG L890 LS L89K, LO L89K, LY L89K LS L896, LA L896, LO L896, LY L896 - TOPLED LS T670, LO T670, LY T670, LG T670, LP T670 LSG T670, LSP T670, LSY T670, LOP T670, LYG T670 LG T671, LOG T671, LSG T671 LB T673, LV T673, LT T673, LW T673 LH T674 LS T676, LA T676, LO T676, LY T676, LB T676, LH T676, LSB T676, LW T676 LB T67C, LV T67C, LT T67C, LS T67K, LO T67K, LY T67K, LW E67C LS E67B, LA E67B, LO E67B, LY E67B, LB E67C, LV E67C, LT E67C LW T67C LS T679, LY T679, LG T679 LS T770, LO T770, LY T770, LG T770, LP T770 LB T773, LV T773, LT T773, LW T773 LH T774 LS E675, LA E675, LY E675, LS T675 LS T776, LA T776, LO T776, LY T776, LB T776 LHGB T686 LT T68C, LB T68C - Hyper Mini TOPLED® LB M676 - Mini TOPLED Santana® LG M470 LS M47K, LO M47K, LY M47K Source: http://www.osram.convergy.de LUXEON: - LUMILED® LXK2-PW12-R00, LXK2-PW12-S00, LXK2-PW14-U00, LXK2-PW14-V00 LXK2-PM12-R00, LXK2-PM12-S00, LXK2-PM14-U00 LXK2-PE12-Q00, LXK2-PE12-R00, LXK2-PE12-S00, LXK2-PE14-T00, LXK2-PE14-U00 LXK2-PB12-K00, LXK2-PB12-L00, LXK2-PB12-M00, LXK2-PB14-N00, LXK2-PB14-P00, LXK2-PB14-Q00 LXK2-PR12-L00, LXK2-PR12-M00, LXK2-PR14-Q00, LXK2-PR14-R00 LXK2-PD12-Q00, LXK2-PD12-R00, LXK2-PD12-S00 LXK2-PH12-R00, LXK2-PH12-S00 LXK2-PL12-P00, LXK2-PL12-Q00, LXK2-PL12-R00 Source: www.luxeon.com KINGBRIGHT: KA-3528ASYC Source: www.kingbright.com
BED BEDOUT EXT1 EXT2 FAN1-FAN4 = con-other:KK-254-2
C1 C2 C4 C6-C10 C12 C14-C54 C56-C67 C69-C80 C82-C93 C95-C106 C108-C113 = resistor:C-EU: CAPACITOR, European symbol
C3 C5 C11 C13 C55 C68 C81 C94 C107 = resistor:CPOL-US: POLARIZED CAPACITOR, American symbol
C114 = rcl:C-EU: CAPACITOR, European symbol; SPICEPREFIX: C
D1 = diode:SCHOTTKY-DIODE: Schottky Diode
D2 = Diodi:0025_SS1P3L-M3/84A: 1A 30V Schottky Barrier Rectifiers -SS1P3L-M3/84A; CASE: SMP; MONTHLY_USAGE: _____; PART_NUMBER: SS1P3L-M3/84A; PRICE: _____; SUPPLIER: _____; TYPE: Diodi
D3 = Arduino:PRTR5V0U2X
D4-D6 = diode:BAT54: Schottky Diodes Source: Fairchild .. BAT54.pdf
ERASE = con-other:J
ESP8266 = adafruit:ESP-12
EXP1 EXP2 = con-panduit:057-010-: CONNECTOR 10-pin series 057 contact pc board low profile headers; OC_FARNELL: unknown; OC_NEWARK: unknown
F1 = misc:MC36207
F2 F3 = fuse:19560: FUSE HOLDER TR5, Wickmann; MPN: 56000001009; OC_FARNELL: 1185363; OC_NEWARK: 15P8392
IC1 = misc:A4403
IC2 = we-power:LDO: LDOs TS1117 800mA max 15V - compatible NCP1117 1A max 20V TS9011 250mA max 12V - compatible AP2210 300mA max 15V TS5204 150mA max 16V
IC3 = misc:ATSAM4S8C
IC4 = 74xx-us:74*125: Quad bus BUFFER, 3-state
IC5 = misc:74AHC08
IC6-IC10 = TMC5130_3D_Printer_BOARD_V_2:TMC5130; OC_DIGIKEY: _
IC11 = 74xx-us:74*32: Quad 2-input OR gate
J1 = misc:MOLEX-105162-001
J2 = con-phoenix-508:MSTBV4: PHOENIX; MPN: MSTBV 2,5/4-GF-5.08; OC_FARNELL: 1792794; OC_NEWARK: 69R9847
L1 L3 = Arduino:INDUCTOR: Inductors
L2 = Arduino-DUE-V03:L-US: INDUCTOR, American symbol
L4-L6 = Zero_V1.0:INDUCTOR: Inductors
MOT-E1 MOT-E2 MOT-X MOT-Y MOT-Z1 MOT-Z2 = con-other:KK-254-4
PWRIN = con-phoenix-508:MSTBA2: PHOENIX; MF: FARNELL; MPN: 1757242; OC_FARNELL: 3705171; OC_NEWARK: 71C4161
Q1 Q2 = misc:NX138BKS
Q3 Q4 = misc:AON7524
R1-R59 R61-R63 R65-R67 R69-R71 R73-R75 R77 = resistor:R-US_: RESISTOR, American symbol
R60 R64 R68 R72 R76 = resistor:R-TRIMM: Trimm resistor
RESET = misc:EVQQ2
USB = SmartPrj:PN61729: BERG USB connector
X1 = misc:CRYSTAL-4PIN
X_STOP Y_STOP Z_STOP = con-other:KK-254-3

## Net classes
3 usbvcc: width 0.102 mm, drill 0.1 mm, clearance 0.15 mm
4 diff: width 0.2 mm